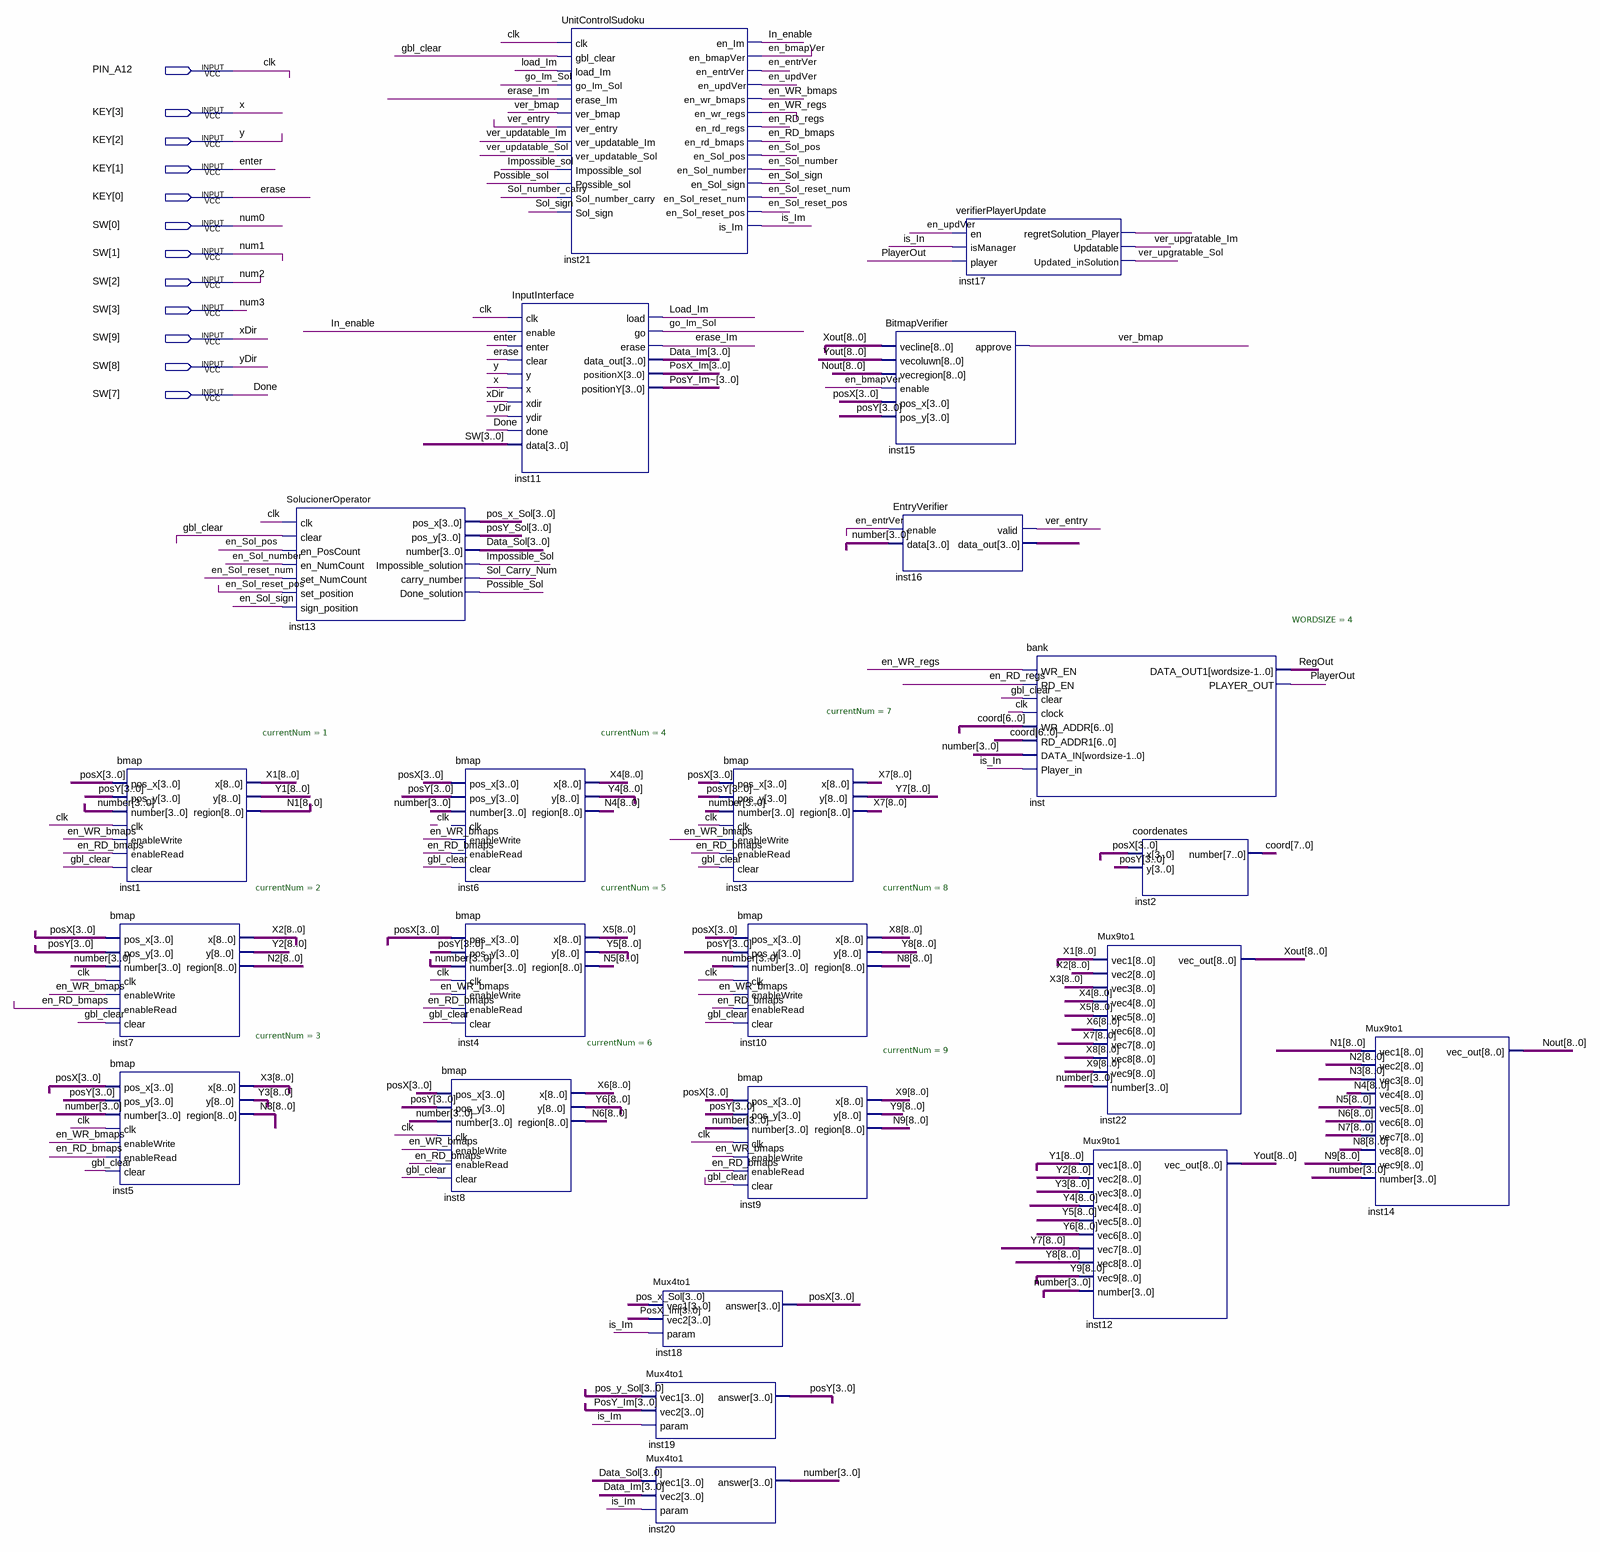
[diagram p0: schematic sheet]
// Quartus schematic Sudoku.bdf as structural Verilog: 23 symbols, 12 pins
module Sudoku (
  input  PIN_A12,
  input  [3:0] KEY,
  input  [9:0] SW
);

  wire en_bmapVer, en_entrVer, en_RD_bmaps, en_RD_regs, en_Sol_number, en_Sol_pos, en_Sol_reset_num,
       en_Sol_reset_pos, en_Sol_sign, en_updVer, en_WR_bmaps, en_WR_regs, erase_Im, gbl_clear, go_Im_Sol,
       Impossible_Sol, In_enable, inst17_regretsolution_player, is_Im, is_In, Load_Im, PlayerOut,
       Possible_Sol, RegOut, Sol_Carry_Num, Sol_number_carry, Sol_sign, ver_bmap, ver_entry,
       ver_updatable_Im, ver_updatable_Sol, ver_upgratable_Im, ver_upgratable_Sol;
  wire [3:0] Data_Im, Data_Sol, inst16_data_out, number, pos_x_Sol, pos_y_Sol, posX, PosX_Im, posY, PosY_Im,
       \PosY_Im~ , posY_Sol;
  wire [7:0] coord;
  wire [8:0] N1, N2, N3, N4, N5, N6, N7, N8, N9, Nout, X1, X2, X3, X4, X5, X6, X7, X8, X9, Xout, Y1, Y2, Y3,
       Y4, Y5, Y6, Y7, Y8, Y9, Yout;

  bmap #(.currentNum(1)) inst1 (
    .pos_x(posX), .pos_y(posY), .number(number), .clk(PIN_A12), .enableWrite(en_WR_bmaps),
    .enableRead(en_RD_bmaps), .clear(gbl_clear), .x(X1), .y(Y1), .region(N1));
  bmap #(.currentNum(2)) inst7 (
    .pos_x(posX), .pos_y(posY), .number(number), .clk(PIN_A12), .enableWrite(en_WR_bmaps),
    .enableRead(en_RD_bmaps), .clear(gbl_clear), .x(X2), .y(Y2), .region(N2));
  bmap #(.currentNum(3)) inst5 (
    .pos_x(posX), .pos_y(posY), .number(number), .clk(PIN_A12), .enableWrite(en_WR_bmaps),
    .enableRead(en_RD_bmaps), .clear(gbl_clear), .x(X3), .y(Y3), .region(N3));
  SolucionerOperator inst13 (
    .clk(PIN_A12), .clear(gbl_clear), .en_PosCount(en_Sol_pos), .en_NumCount(en_Sol_number),
    .set_NumCount(en_Sol_reset_num), .set_position(en_Sol_reset_pos), .sign_position(en_Sol_sign),
    .pos_x(pos_x_Sol), .pos_y(posY_Sol), .number(Data_Sol), .Impossible_solution(Impossible_Sol),
    .carry_number(Sol_Carry_Num), .Done_solution(Possible_Sol));
  bmap #(.currentNum(4)) inst6 (
    .pos_x(posX), .pos_y(posY), .number(number), .enableWrite(en_WR_bmaps), .enableRead(en_RD_bmaps),
    .clear(gbl_clear), .x(X4), .y(Y4), .region(N4));  // open: clk
  bmap #(.currentNum(5)) inst4 (
    .pos_x(posX), .pos_y(posY), .number(number), .clk(PIN_A12), .enableWrite(en_WR_bmaps),
    .enableRead(en_RD_bmaps), .clear(gbl_clear), .x(X5), .y(Y5), .region(N5));
  bmap #(.currentNum(6)) inst8 (
    .pos_x(posX), .pos_y(posY), .number(number), .clk(PIN_A12), .enableWrite(en_WR_bmaps),
    .enableRead(en_RD_bmaps), .clear(gbl_clear), .x(X6), .y(Y6), .region(N6));
  InputInterface inst11 (
    .clk(PIN_A12), .enable(In_enable), .enter(KEY[1]), .clear(KEY[0]), .y(KEY[2]), .x(KEY[3]), .xdir(SW[9]),
    .ydir(SW[8]), .done(SW[7]), .data(SW[3:0]), .load(Load_Im), .go(go_Im_Sol), .erase(erase_Im),
    .data_out(Data_Im), .positionX(PosX_Im), .positionY(\PosY_Im~ ));
  UnitControlSudoku inst21 (
    .clk(PIN_A12), .gbl_clear(gbl_clear), .load_Im(Load_Im), .go_Im_Sol(go_Im_Sol), .erase_Im(erase_Im),
    .ver_bmap(ver_bmap), .ver_entry(ver_entry), .ver_updatable_Im(ver_updatable_Im),
    .ver_updatable_Sol(ver_updatable_Sol), .Impossible_sol(Impossible_Sol), .Possible_sol(Possible_Sol),
    .Sol_number_carry(Sol_number_carry), .Sol_sign(Sol_sign), .en_Im(In_enable), .en_bmapVer(en_bmapVer),
    .en_entrVer(en_entrVer), .en_updVer(en_updVer), .en_wr_bmaps(en_WR_bmaps), .en_wr_regs(en_WR_regs),
    .en_rd_regs(en_RD_regs), .en_rd_bmaps(en_RD_bmaps), .en_Sol_pos(en_Sol_pos),
    .en_Sol_number(en_Sol_number), .en_Sol_sign(en_Sol_sign), .en_Sol_reset_num(en_Sol_reset_num),
    .en_Sol_reset_pos(en_Sol_reset_pos), .is_Im(is_Im));
  Mux4to1 inst19 (.vec1(pos_y_Sol), .vec2(PosY_Im), .param(is_Im), .answer(posY));
  Mux4to1 inst20 (.vec1(Data_Sol), .vec2(Data_Im), .param(is_Im), .answer(number));
  Mux4to1 inst18 (.vec1(pos_x_Sol), .vec2(PosX_Im), .param(is_Im), .answer(posX));
  bmap #(.currentNum(7)) inst3 (
    .pos_x(posX), .pos_y(posY), .number(number), .clk(PIN_A12), .enableWrite(en_WR_bmaps),
    .enableRead(en_RD_bmaps), .clear(gbl_clear), .x(X7), .y(Y7), .region(X7));
  bmap #(.currentNum(8)) inst10 (
    .pos_x(posX), .pos_y(posY), .number(number), .clk(PIN_A12), .enableWrite(en_WR_bmaps),
    .enableRead(en_RD_bmaps), .clear(gbl_clear), .x(X8), .y(Y8), .region(N8));
  bmap #(.currentNum(9)) inst9 (
    .pos_x(posX), .pos_y(posY), .number(number), .clk(PIN_A12), .enableWrite(en_WR_bmaps),
    .enableRead(en_RD_bmaps), .clear(gbl_clear), .x(X9), .y(Y9), .region(N9));
  BitmapVerifier inst15 (
    .vecline(Xout), .vecoluwn(Yout), .vecregion(Nout), .enable(en_bmapVer), .pos_x(posX), .pos_y(posY),
    .approve(ver_bmap));
  EntryVerifier inst16 (.enable(en_entrVer), .data(number), .valid(ver_entry), .data_out(inst16_data_out));
  verifierPlayerUpdate inst17 (
    .en(en_updVer), .isManager(is_In), .player(PlayerOut),
    .regretSolution_Player(inst17_regretsolution_player), .Updatable(ver_upgratable_Im),
    .Updated_inSolution(ver_upgratable_Sol));
  bank #(.WORDSIZE(4)) inst (
    .WR_EN(en_WR_regs), .RD_EN(en_RD_regs), .clear(gbl_clear), .clock(PIN_A12), .WR_ADDR(coord[6:0]),
    .RD_ADDR1(coord[6:0]), .DATA_IN(number), .Player_in(is_In), .DATA_OUT1(RegOut), .PLAYER_OUT(PlayerOut));
  Mux9to1 inst22 (
    .vec1(X1), .vec2(X2), .vec3(X3), .vec4(X4), .vec5(X5), .vec6(X6), .vec7(X7), .vec8(X8), .vec9(X9),
    .number(number), .vec_out(Xout));
  Mux9to1 inst12 (
    .vec1(Y1), .vec2(Y2), .vec3(Y3), .vec4(Y4), .vec5(Y5), .vec6(Y6), .vec7(Y7), .vec8(Y8), .vec9(Y9),
    .number(number), .vec_out(Yout));
  coordenates inst2 (.x(posX), .y(posY), .number(coord));
  Mux9to1 inst14 (
    .vec1(N1), .vec2(N2), .vec3(N3), .vec4(N4), .vec5(N5), .vec6(N6), .vec7(N7), .vec8(N8), .vec9(N9),
    .number(number), .vec_out(Nout));

  // Other names for the same wires on the sheet: clk = PIN_A12; Done = SW[7]; enter = KEY[1]; erase = KEY[0];
  //   num0 = SW[0]; num1 = SW[1]; num2 = SW[2]; num3 = SW[3]; x = KEY[3]; xDir = SW[9]; y = KEY[2]; yDir = SW[8]
endmodule
